# EAGLE schematic MCU_v14 (EAGLE 9.7.0)
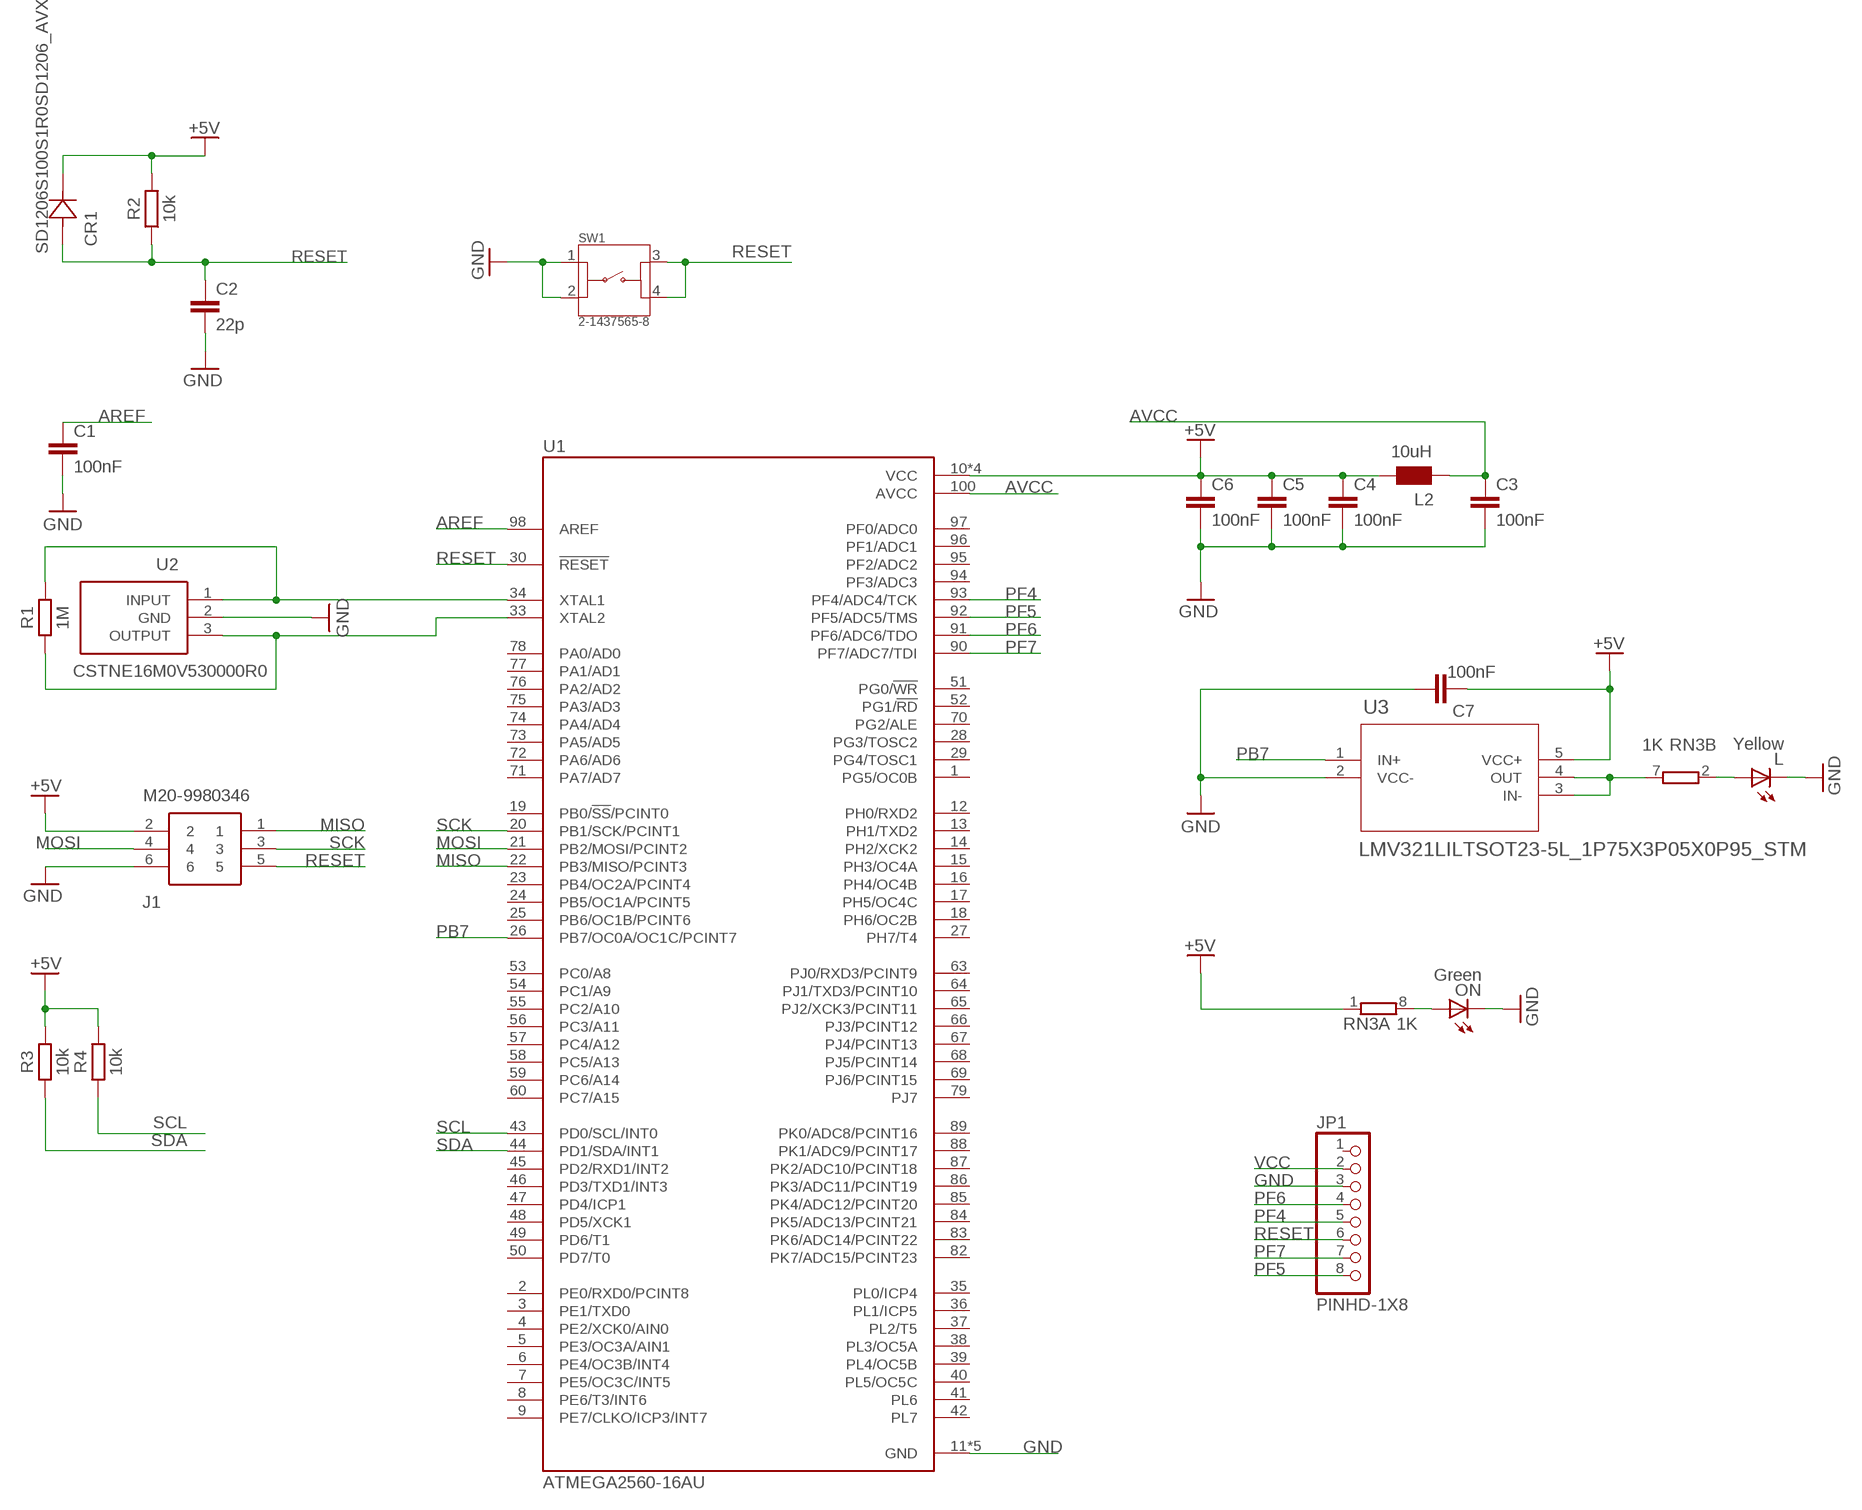
[diagram p0: schematic, sheet 1]

## Parts
C1  100nF  0015_100NF_0603  [C0603-ROUND]
C2  22p  0014_22PF_0603  [C0603-ROUND]
C3  100nF  0015_100NF_0603  [C0603-ROUND]
C4  100nF  0015_100NF_0603  [C0603-ROUND]
C5  100nF  0015_100NF_0603  [C0603-ROUND]
C6  100nF  0015_100NF_0603  [C0603-ROUND]
C7  100nF  0015_100NF_0603  [C0603-ROUND]
CR1  SD1206S100S1R0SD1206_AVX  [SD1206_AVX]
J1  M20-9980346  [HDRV6W64P254_2X3_762X508X868P]
JP1  PINHD-1X8  [1X08]
L  Yellow  0044_KPT-2012YC  [CHIPLED_0805]
L2  10uH  0715_CV201210-100K  [0805]
ON  Green  0043_KPT-2012SGC  [CHIPLED_0805]
R1  1M  R_CHIP-0603(1608-METRIC)  [RESC1608X60]
R2  10k  R_CHIP-0805(2012-METRIC)  [RESC2012X65]
R3  10k  R_CHIP-0805(2012-METRIC)  [RESC2012X65]
R4  10k  R_CHIP-0805(2012-METRIC)  [RESC2012X65]
RN3  1K  0005_064R_1K_/_CAY16-102J4LF  [CAY16]
SW1  2-1437565-8  [SW_SMD_2-1437565-8_4_4.50_6.00_6.00_5.00]
U1  ATMEGA2560-16AU  [QFP50P1600X1600X120-100N]
U2  CSTNE16M0V530000R0  [CSTNE16M0V530000R0]
U3  LMV321LILTSOT23-5L_1P75X3P05X0P95_STM  [SOT23-5L_1P75X3P05X0P95_STM]

## Nets
+5V: C4.1 C5.1 C6.1 C7.1 CR1.1 J1.2 L2.2 R2.2 R3.2 R4.2 RN3.1 U1.10(VCC) U1.31(VCC) U1.61(VCC) U1.80(VCC) U3.5(VCC+)
AREF: C1.1 U1.98(AREF)
AVCC [power usb]: C3.1 L2.1 U1.100(AVCC)
GND: C1.2 C2.2 C3.2 C4.2 C5.2 C6.2 C7.2 J1.6 JP1.3 L.C ON.C SW1.1 SW1.2 U1.11(GND) U1.32(GND) U1.62(GND) U1.81(GND) U1.99(GND) U2.2(GND) U3.2(VCC-)
MISO: J1.1 U1.22(PB3/MISO/PCINT3)
MOSI: J1.4 U1.21(PB2/MOSI/PCINT2)
N$1: R1.2 U1.34(XTAL1) U2.1(INPUT)
N$2: L.A RN3.2
N$3: ON.A RN3.8
N$4: R1.1 U1.33(XTAL2) U2.3(OUTPUT)
N$5: RN3.7 U3.3(IN-) U3.4(OUT)
PB7: U1.26(PB7/OC0A/OC1C/PCINT7) U3.1(IN+)
PF4: JP1.5 U1.93(PF4/ADC4/TCK)
PF5: JP1.8 U1.92(PF5/ADC5/TMS)
PF6: JP1.4 U1.91(PF6/ADC6/TDO)
PF7: JP1.7 U1.90(PF7/ADC7/TDI)
RESET: C2.1 CR1.2 J1.5 JP1.6 R2.1 SW1.3 SW1.4 U1.30(!RESET)
SCK: J1.3 U1.20(PB1/SCK/PCINT1)
SCL: R4.1 U1.43(PD0/SCL/INT0)
SDA: R3.1 U1.44(PD1/SDA/INT1)
VCC: JP1.2
Unconnected: JP1.1 RN3.3 RN3.4 RN3.5 RN3.6 U1.1(PG5/OC0B) U1.2(PE0/RXD0/PCINT8) U1.3(PE1/TXD0) U1.4(PE2/XCK0/AIN0) U1.5(PE3/OC3A/AIN1) U1.6(PE4/OC3B/INT4) U1.7(PE5/OC3C/INT5) U1.8(PE6/T3/INT6) U1.9(PE7/CLKO/ICP3/INT7) U1.12(PH0/RXD2) U1.13(PH1/TXD2) U1.14(PH2/XCK2) U1.15(PH3/OC4A) U1.16(PH4/OC4B) U1.17(PH5/OC4C) U1.18(PH6/OC2B) U1.19(PB0/!SS!/PCINT0) U1.23(PB4/OC2A/PCINT4) U1.24(PB5/OC1A/PCINT5) U1.25(PB6/OC1B/PCINT6) U1.27(PH7/T4) U1.28(PG3/TOSC2) U1.29(PG4/TOSC1) U1.35(PL0/ICP4) U1.36(PL1/ICP5) U1.37(PL2/T5) U1.38(PL3/OC5A) U1.39(PL4/OC5B) U1.40(PL5/OC5C) U1.41(PL6) U1.42(PL7) U1.45(PD2/RXD1/INT2) U1.46(PD3/TXD1/INT3) U1.47(PD4/ICP1) U1.48(PD5/XCK1) U1.49(PD6/T1) U1.50(PD7/T0) U1.51(PG0/!WR) U1.52(PG1/!RD) U1.53(PC0/A8) U1.54(PC1/A9) U1.55(PC2/A10) U1.56(PC3/A11) U1.57(PC4/A12) U1.58(PC5/A13) U1.59(PC6/A14) U1.60(PC7/A15) U1.63(PJ0/RXD3/PCINT9) U1.64(PJ1/TXD3/PCINT10) U1.65(PJ2/XCK3/PCINT11) U1.66(PJ3/PCINT12) U1.67(PJ4/PCINT13) U1.68(PJ5/PCINT14) U1.69(PJ6/PCINT15) U1.70(PG2/ALE) U1.71(PA7/AD7) U1.72(PA6/AD6) U1.73(PA5/AD5) U1.74(PA4/AD4) U1.75(PA3/AD3) U1.76(PA2/AD2) U1.77(PA1/AD1) U1.78(PA0/AD0) U1.79(PJ7) U1.82(PK7/ADC15/PCINT23) U1.83(PK6/ADC14/PCINT22) U1.84(PK5/ADC13/PCINT21) U1.85(PK4/ADC12/PCINT20) U1.86(PK3/ADC11/PCINT19) U1.87(PK2/ADC10/PCINT18) U1.88(PK1/ADC9/PCINT17) U1.89(PK0/ADC8/PCINT16) U1.94(PF3/ADC3) U1.95(PF2/ADC2) U1.96(PF1/ADC1) U1.97(PF0/ADC0)

## Library data of the parts
C1 C3-C7 = Condensatori:0015_100NF_0603: 100nF 0603 50V; CASE: 0603; MONTHLY_USAGE: _____; PART_NUMBER: cl10b104kbnc; PRICE: _____; SUPPLIER: _____; TYPE: Condensatori
C2 = Condensatori:0014_22PF_0603: 22pF 0603; CASE: 0603; MONTHLY_USAGE: _____; PART_NUMBER: 22pF_0603; PRICE: _____; SUPPLIER: _____; TYPE: Condensatori
CR1 = Switching Diode:SD1206S100S1R0; COPYRIGHT: Copyright (C) 2024 Ultra Librarian. All rights reserved.; MANUFACTURER_PART_NUMBER: SD1206S100S1R0; MFR_NAME: KYOCERA AVX
J1 = M20-9980346:M20-9980346: 03+03 DIL Vertical Pin Header HARWIN M20 Series, 2.54mm Pitch 6 Way 2 Row Straight PCB Header, Solder Termination, 3A Source: Datasheet <https://cdn.harwin.com/pdfs/M20-998.pdf>; DESCRIPTION: 03+03 DIL Vertical Pin Header HARWIN M20 Series, 2.54mm Pitch 6 Way 2 Row Straight PCB Header, Solder Termination, 3A; HEIGHT: 8.68mm; MANUFACTURER_NAME: Harwin; MANUFACTURER_PART_NUMBER: M20-9980346; MOUSER_PART_NUMBER: 855-M20-9980346; MOUSER_PRICE-STOCK: https://www.mouser.co.uk/ProductDetail/Harwin/M20-9980346?qs=%252Bk6%2F5FB6qrmHk2P20oz3FA%3D%3D
JP1 = Connector:PINHD-1X8: PIN HEADER; CATEGORY: Headers; DESCRIPTION: Header, Straight, 8 Position; MANUFACTURER: Generic; MPN: Generic; OPERATING_TEMPERATURE: Generic; PART_STATUS: Active; PITCH: 0.100" (2.54mm); ROHS_COMPLIANCE: Generic; SERIES: Generic; SUB-CATEGORY: Headers, Male Pins; TYPE: Board to Board or Cable, Unshrouded, Through Hole, Straight
L = Opto:0044_KPT-2012YC: LED YELLOW - SMD - 0805; MONTHLY_USAGE: _____; PART_NUMBER: KPT-2012YC; PRICE: _____; SUPPLIER: _____; TYPE: Opto
L2 = Induttanze:0715_CV201210-100K: 10uH 0805; CASE: 0805; MONTHLY_USAGE: _____; PART_NUMBER: CV201210-100K; PRICE: _____; SUPPLIER: _____; TYPE: Induttanze
ON = Opto:0043_KPT-2012SGC: LED GREEN - SMD-0805; MONTHLY_USAGE: _____; PART_NUMBER: KPT-2012SGC; PRICE: _____; SUPPLIER: _____; TYPE: Opto
R1-R4 = Resistor:R: Resistor Fixed - Generic; CATEGORY: Resistor; SUB-CATEGORY: Fixed
RN3 = Resistenze:0005_064R_1K_/_CAY16-102J4LF: 1K 064R; CASE: SMD_3,2x1,6; MONTHLY_USAGE: _____; PART_NUMBER: 064R_1K_/_CAY16-102J4LF; PRICE: _____; SUPPLIER: _____; TYPE: Resistenze
SW1 = 2-1437565-8:2-1437565-8: Switch Tactile OFF (ON) SPST Round Button Gull Wing 0.05A 12VDC 2.55N SMD; MANUFACTURER: TE connectivity
U1 = ATmega2560-16AU:ATMEGA2560-16AU; MANUFACTURER: Microchip Technology; MAXIMUM_PACKAGE_HEIGHT: 1.2mm; PARTREV: DS40002211A-05/2020; SNAPEDA_PN: ATMEGA640V-8AUR; STANDARD: IPC-7351B
U2 = CSTNE16M0V530000R0:CSTNE16M0V530000R0: Resonators 16.0000MHz 15pF SMD CHP Resntr Source: Datasheet <https://www.murata.com/products/productdata/8801160822814/SPEC-CSTNE16M0V530000R0.pdf>; DESCRIPTION: Resonators 16.0000MHz 15pF SMD CHP Resntr; HEIGHT: 1mm; MANUFACTURER_NAME: Murata Electronics; MANUFACTURER_PART_NUMBER: CSTNE16M0V530000R0; MOUSER_PART_NUMBER: 81-CSTNE16M0V530000R; MOUSER_PRICE-STOCK: https://www.mouser.co.uk/ProductDetail/Murata-Electronics/CSTNE16M0V530000R0?qs=y6ZabgHbY%252BzQcQICtMt%2F3w%3D%3D
U3 = Op Amp:LMV321LILT; COPYRIGHT: Copyright (C) 2024 Ultra Librarian. All rights reserved.; MANUFACTURER_PART_NUMBER: LMV321LILT; MFR_NAME: STMicroelectronics

## Net classes
0 default: width 0.203 mm, drill 0.406 mm, clearance 0.203 mm
1 power: width 0.61 mm, drill 0.406 mm, clearance 0.203 mm
2 gnd: width 0.305 mm, drill 0.406 mm, clearance 0.203 mm
3 power usb: width 0.508 mm, drill 0.406 mm, clearance 0.203 mm